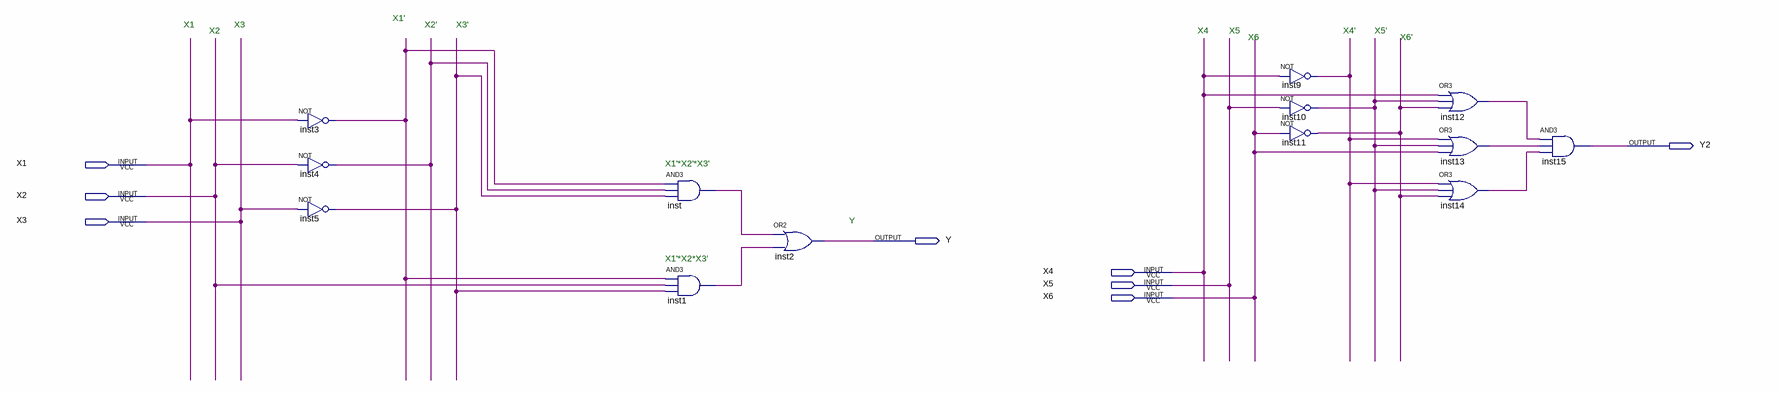
[diagram p0: schematic sheet]
// Quartus schematic Functions.bdf as structural Verilog: 13 symbols, 8 pins
module Functions (
  input  X1,
  input  X2,
  input  X3,
  input  X4,
  input  X5,
  input  X6,
  output Y2,
  output Y
);

  wire inst1_out, inst3_out, inst4_out, inst5_out, inst9_out, inst10_out, inst11_out, inst12_out, inst13_out,
       inst14_out, inst_out;

  not inst3 (inst3_out, X1);
  not inst4 (inst4_out, X2);
  not inst5 (inst5_out, X3);
  and inst (inst_out, inst3_out, inst4_out, inst5_out);
  and inst1 (inst1_out, inst3_out, X2, inst5_out);
  or inst2 (Y, inst_out, inst1_out);
  not inst9 (inst9_out, X4);
  not inst10 (inst10_out, X5);
  not inst11 (inst11_out, X6);
  or inst12 (inst12_out, X4, inst10_out, inst11_out);
  or inst13 (inst13_out, inst9_out, inst10_out, X6);
  or inst14 (inst14_out, inst9_out, inst10_out, inst11_out);
  and inst15 (Y2, inst12_out, inst13_out, inst14_out);

  // Notes on the sheet:
  //   X1'
  //   X1
  //   X3
  //   X2'
  //   X3'
  //   X2
  //   X4
  //   X5
  //   X4'
  //   X5'
  //   X6
  //   X6'
  //   X1'*X2'*X3'
  //   Y
  //   X1'*X2*X3'
endmodule
